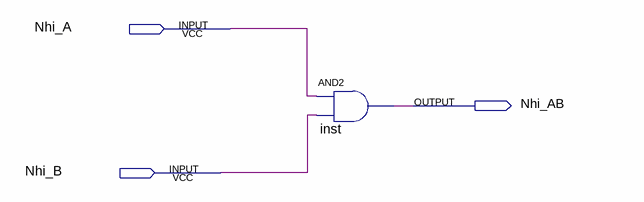
[diagram p0: schematic sheet]
// Quartus schematic Assignment2.bdf as structural Verilog: 1 symbols, 3 pins
module Assignment2 (
  input  Nhi_A,
  input  Nhi_B,
  output Nhi_AB
);

  and inst (Nhi_AB, Nhi_A, Nhi_B);
endmodule
